# Altium schematic sheet SFPextensionSplit.SchDoc
size A4
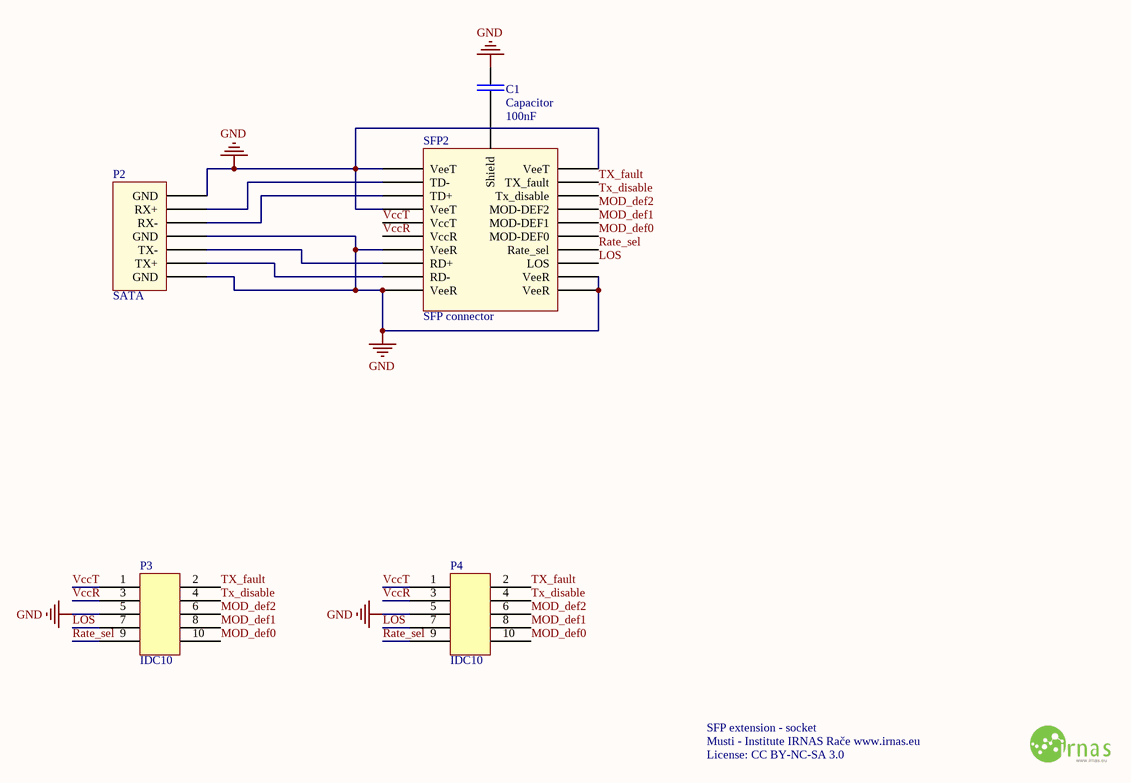
[diagram p0: SFPextensionSplit.SchDoc]

## Parts
C1  Capacitor  value 100nF  [RESC2012X06N]
P2  SATA  [SATA pcb]
P3  IDC10  [IDC10]
P4  IDC10  [IDC10]
SFP2  SFP connector  [SFP receptacle]

## Nets
GND: C1.1 P2.1(GND) P2.4(GND) P2.7(GND) P3.5 P4.5 SFP2.1(VeeT) SFP2.9(VeeR) SFP2.10(VeeR) SFP2.11(VeeR) SFP2.14(VeeR) SFP2.17(VeeT) SFP2.20(VeeT)
LOS: P3.7 P4.7 SFP2.8(LOS)
MOD_def0: P3.10 P4.10 SFP2.6(MOD-DEF0)
MOD_def1: P3.8 P4.8 SFP2.5(MOD-DEF1)
MOD_def2: P3.6 P4.6 SFP2.4(MOD-DEF2)
Rate_sel: P3.9 P4.9 SFP2.7(Rate_sel)
Tx_disable: P3.4 P4.4 SFP2.3(Tx_disable)
TX_fault: P3.2 P4.2 SFP2.2(TX_fault)
VccR: P3.3 P4.3 SFP2.15(VccR)
VccT: P3.1(A) P4.1(A) SFP2.16(VccT)
NetC1_2: C1.2 SFP2.21(Shield)
NetP2_2: P2.2(TX+) SFP2.12(RD-)
NetP2_3: P2.3(TX-) SFP2.13(RD+)
NetP2_5: P2.5(RX-) SFP2.18(TD+)
NetP2_6: P2.6(RX+) SFP2.19(TD-)

## Notes on the sheet
- SFP extension - socket
- Musti - Institute IRNAS Rače www.irnas.eu
- License: CC BY-NC-SA 3.0

## Library data of the parts
C1 = Capacitor: General capacitor
P3 P4 = IDC10: IDC 10pin